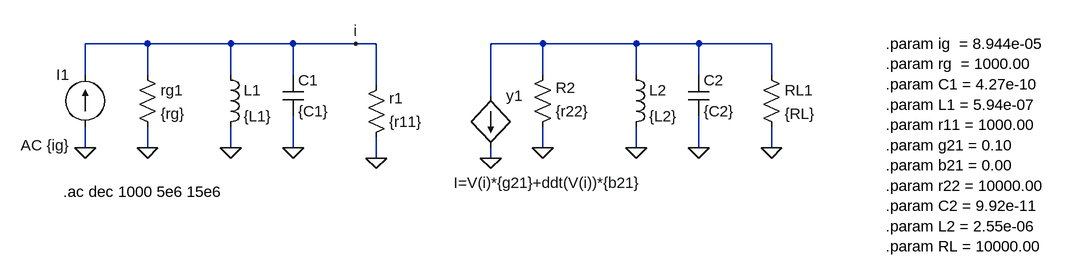
[diagram p0: schematic eje2.asc]
eje2.asc, the LTspice schematic file:
Version 4
SHEET 1 1204 680
WIRE -400 128 -496 128
WIRE -272 128 -400 128
WIRE -176 128 -272 128
WIRE -80 128 -176 128
WIRE -48 128 -80 128
WIRE 208 128 128 128
WIRE 352 128 208 128
WIRE 448 128 352 128
WIRE 560 128 448 128
WIRE -496 176 -496 128
WIRE -400 176 -400 128
WIRE -272 176 -272 128
WIRE -176 176 -176 128
WIRE 208 176 208 128
WIRE 352 176 352 128
WIRE 448 176 448 128
WIRE 560 176 560 128
WIRE -48 192 -48 128
WIRE 128 208 128 128
WIRE -496 288 -496 256
WIRE -400 288 -400 256
WIRE -272 288 -272 256
WIRE -176 288 -176 240
WIRE 208 288 208 256
WIRE 352 288 352 256
WIRE 448 288 448 240
WIRE 560 288 560 256
WIRE -48 304 -48 272
WIRE 128 304 128 288
FLAG 208 288 0
FLAG -272 288 0
FLAG -176 288 0
FLAG -48 304 0
FLAG -496 288 0
FLAG 560 288 0
FLAG -400 288 0
FLAG 128 304 0
FLAG 352 288 0
FLAG 448 288 0
FLAG -80 128 i
SYMBOL res -64 288 M180
WINDOW 0 36 76 Left 2
WINDOW 3 36 40 Left 2
SYMATTR InstName r1
SYMATTR Value {r11}
SYMBOL res -416 160 R0
SYMATTR InstName rg1
SYMATTR Value {rg}
SYMBOL res 192 272 M180
WINDOW 0 36 76 Left 2
WINDOW 3 36 40 Left 2
SYMATTR InstName R2
SYMATTR Value {r22}
SYMBOL ind -288 160 R0
SYMATTR InstName L1
SYMATTR Value {L1}
SYMBOL cap -192 176 R0
SYMATTR InstName C1
SYMATTR Value {C1}
SYMBOL res 544 160 R0
SYMATTR InstName RL1
SYMATTR Value {RL}
SYMBOL bi 128 208 R0
WINDOW 3 -57 134 Left 2
SYMATTR Value I=V(i)*{g21}+ddt(V(i))*{b21}
SYMATTR InstName y1
SYMBOL current -496 256 R180
WINDOW 0 24 80 Left 2
WINDOW 3 24 0 Left 2
WINDOW 123 24 -28 Left 2
WINDOW 39 0 0 Left 2
SYMATTR InstName I1
SYMATTR Value ""
SYMATTR Value2 AC {ig}
SYMBOL ind 336 160 R0
SYMATTR InstName L2
SYMATTR Value {L2}
SYMBOL cap 432 176 R0
SYMATTR InstName C2
SYMATTR Value {C2}
TEXT -530 356 Left 2 !.ac dec 1000 5e6 15e6
TEXT 736 128 Left 2 !.param ig  = 8.944e-05\n.param rg  = 1000.00\n.param C1 = 4.27e-10\n.param L1 = 5.94e-07\n.param r11 = 1000.00\n.param g21 = 0.10\n.param b21 = 0.00\n.param r22 = 10000.00\n.param C2 = 9.92e-11\n.param L2 = 2.55e-06\n.param RL = 10000.00

The netlist it stands for:
* eje2.asc
r1 0 i {r11}
rg1 i 0 {rg}
R2 0 N001 {r22}
L1 i 0 {L1}
C1 i 0 {C1}
RL1 N001 0 {RL}
B§y1 N001 0 I=V(i)*{g21}+ddt(V(i))*{b21}
I1 0 i AC {ig}
L2 N001 0 {L2}
C2 N001 0 {C2}
.ac dec 1000 5e6 15e6
.param ig  = 8.944e-05
.param rg  = 1000.00
.param C1 = 4.27e-10
.param L1 = 5.94e-07
.param r11 = 1000.00
.param g21 = 0.10
.param b21 = 0.00
.param r22 = 10000.00
.param C2 = 9.92e-11
.param L2 = 2.55e-06
.param RL = 10000.00
.backanno
.end